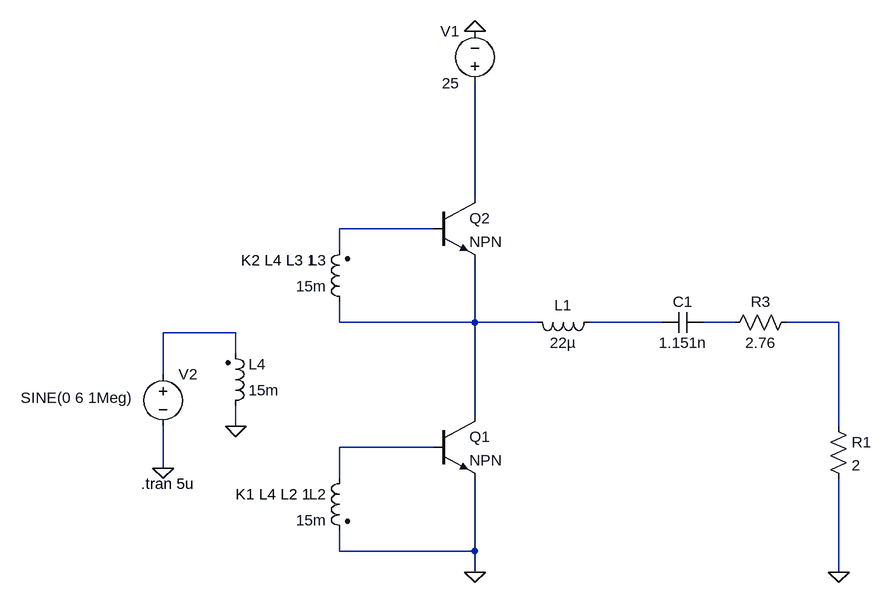
[diagram p0: schematic ClaseD BJT.asc]
ClaseD BJT.asc, the LTspice schematic file:
Version 4
SHEET 1 880 680
WIRE 160 -144 160 -320
WIRE 96 -96 -48 -96
WIRE -48 -64 -48 -96
WIRE -48 48 -48 16
WIRE 160 48 160 -48
WIRE 160 48 -48 48
WIRE 256 48 160 48
WIRE 448 48 336 48
WIRE 560 48 512 48
WIRE 720 48 640 48
WIRE -208 64 -320 64
WIRE -208 96 -208 64
WIRE -320 128 -320 64
WIRE 160 192 160 48
WIRE -208 208 -208 176
WIRE 720 208 720 48
WIRE 96 240 -48 240
WIRE -320 272 -320 208
WIRE -48 288 -48 240
WIRE -48 400 -48 368
WIRE 160 400 160 288
WIRE 160 400 -48 400
WIRE 160 432 160 400
WIRE 720 432 720 288
FLAG 720 432 0
FLAG 160 432 0
FLAG 160 -400 0
FLAG -320 272 0
FLAG -208 208 0
SYMBOL npn 96 192 R0
SYMATTR InstName Q1
SYMBOL npn 96 -144 R0
SYMATTR InstName Q2
SYMBOL voltage 160 -304 R180
WINDOW 0 24 96 Left 2
WINDOW 3 24 16 Left 2
SYMATTR InstName V1
SYMATTR Value 25
SYMBOL ind 352 32 R90
WINDOW 0 5 56 VBottom 2
WINDOW 3 32 56 VTop 2
SYMATTR InstName L1
SYMATTR Value 22µ
SYMBOL cap 512 32 R90
WINDOW 0 0 32 VBottom 2
WINDOW 3 32 32 VTop 2
SYMATTR InstName C1
SYMATTR Value 1.151n
SYMBOL res 704 192 R0
SYMATTR InstName R1
SYMATTR Value 2
SYMBOL res 656 32 R90
WINDOW 0 0 56 VBottom 2
WINDOW 3 32 56 VTop 2
SYMATTR InstName R3
SYMATTR Value 2.76
SYMBOL ind2 -32 272 M0
SYMATTR InstName L2
SYMATTR Value 15m
SYMBOL ind2 -32 32 R180
WINDOW 0 36 80 Left 2
WINDOW 3 36 40 Left 2
SYMATTR InstName L3
SYMATTR Value 15m
SYMBOL ind2 -224 192 M180
WINDOW 0 36 80 Left 2
WINDOW 3 36 40 Left 2
SYMATTR InstName L4
SYMATTR Value 15m
SYMATTR SpiceLine Rser=1m
SYMBOL voltage -320 112 R0
WINDOW 3 -219 52 Left 2
WINDOW 123 0 0 Left 0
WINDOW 39 0 0 Left 0
SYMATTR InstName V2
SYMATTR Value SINE(0 6 1Meg)
TEXT -354 296 Left 2 !.tran 5u
TEXT -200 -48 Left 2 !K2 L4 L3 1
TEXT -208 312 Left 2 !K1 L4 L2 1

The netlist it stands for:
* ClaseD BJT.asc
Q1 N003 N008 0 0 NPN
Q2 N001 N002 N003 0 NPN
V1 N001 0 25
L1 N004 N003 22µ
C1 N005 N004 1.151n
R1 N006 0 2
R3 N006 N005 2.76
L2 N008 0 15m
L3 N003 N002 15m
L4 0 N007 15m Rser=1m
V2 N007 0 SINE(0 6 1Meg)
.model NPN NPN
.model PNP PNP
.lib standard.bjt
.tran 5u
K2 L4 L3 1
K1 L4 L2 1
.backanno
.end